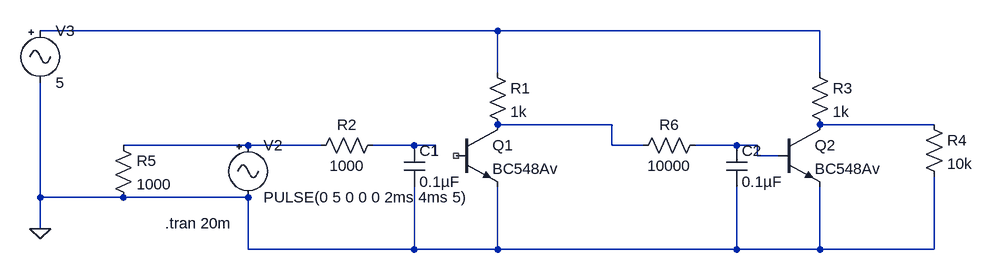
[diagram p0: schematic Capacitor_Teste1.asc]
Capacitor_Teste1.asc, the LTspice schematic file:
Version 4
SHEET 1 1156 680
WIRE 416 0 -288 0
WIRE 912 0 416 0
WIRE 416 64 416 0
WIRE 912 64 912 0
WIRE 592 144 416 144
WIRE 1088 144 912 144
WIRE 32 176 -160 176
WIRE 144 176 32 176
WIRE 288 176 224 176
WIRE 320 176 288 176
WIRE 592 176 592 144
WIRE 640 176 592 176
WIRE 784 176 720 176
WIRE 816 176 784 176
WIRE 320 192 320 176
WIRE 816 192 816 176
WIRE 848 192 816 192
WIRE -288 256 -288 80
WIRE -160 256 -288 256
WIRE 32 256 -160 256
WIRE -288 304 -288 256
WIRE 32 336 32 256
WIRE 288 336 288 240
WIRE 288 336 32 336
WIRE 416 336 416 240
WIRE 416 336 288 336
WIRE 784 336 784 240
WIRE 784 336 416 336
WIRE 912 336 912 240
WIRE 912 336 784 336
WIRE 1088 336 1088 224
WIRE 1088 336 912 336
FLAG -288 304 0
SYMBOL npn 352 144 R0
SYMATTR InstName Q1
SYMATTR Value BC548Av
SYMBOL res 400 48 R0
SYMATTR InstName R1
SYMATTR Value 1k
SYMBOL Misc\\signal 32 160 R0
WINDOW 123 0 0 Left 2
WINDOW 39 0 0 Left 2
SYMATTR InstName V2
SYMATTR Value PULSE(0 5 0 0 0 2ms 4ms 5)
SYMBOL Misc\\signal -288 -16 R0
WINDOW 123 0 0 Left 2
WINDOW 39 0 0 Left 2
SYMATTR InstName V3
SYMATTR Value 5
SYMBOL res 240 160 R90
WINDOW 0 0 56 VBottom 2
WINDOW 3 32 56 VTop 2
SYMATTR InstName R2
SYMATTR Value 1000
SYMBOL npn 848 144 R0
SYMATTR InstName Q2
SYMATTR Value BC548Av
SYMBOL res 896 48 R0
SYMATTR InstName R3
SYMATTR Value 1k
SYMBOL res 1072 128 R0
SYMATTR InstName R4
SYMATTR Value 10k
SYMBOL res 736 160 R90
WINDOW 0 0 56 VBottom 2
WINDOW 3 32 56 VTop 2
SYMATTR InstName R6
SYMATTR Value 10000
SYMBOL cap 272 176 R0
SYMATTR InstName C1
SYMATTR Value 0.1µF
SYMBOL cap 768 176 R0
SYMATTR InstName C2
SYMATTR Value 0.1µF
SYMBOL res -176 160 R0
SYMATTR InstName R5
SYMATTR Value 1000
TEXT -96 296 Left 2 !.tran 20m

The netlist it stands for:
* Capacitor_Teste1.asc
Q1 N002 NC_01 0 0 BC548Av
R1 N001 N002 1k
V2 N004 0 PULSE(0 5 0 0 0 2ms 4ms 5)
V3 N001 0 5
R2 N005 N004 1000
Q2 N003 N006 0 0 BC548Av
R3 N001 N003 1k
R4 N003 0 10k
R6 N006 N002 10000
C1 N005 0 0.1µF
C2 N006 0 0.1µF
R5 N004 0 1000
.model NPN NPN
.model PNP PNP
.lib standard.bjt
.tran 20m
.backanno
.end